# Altium project Expand_Board.PrjPcb
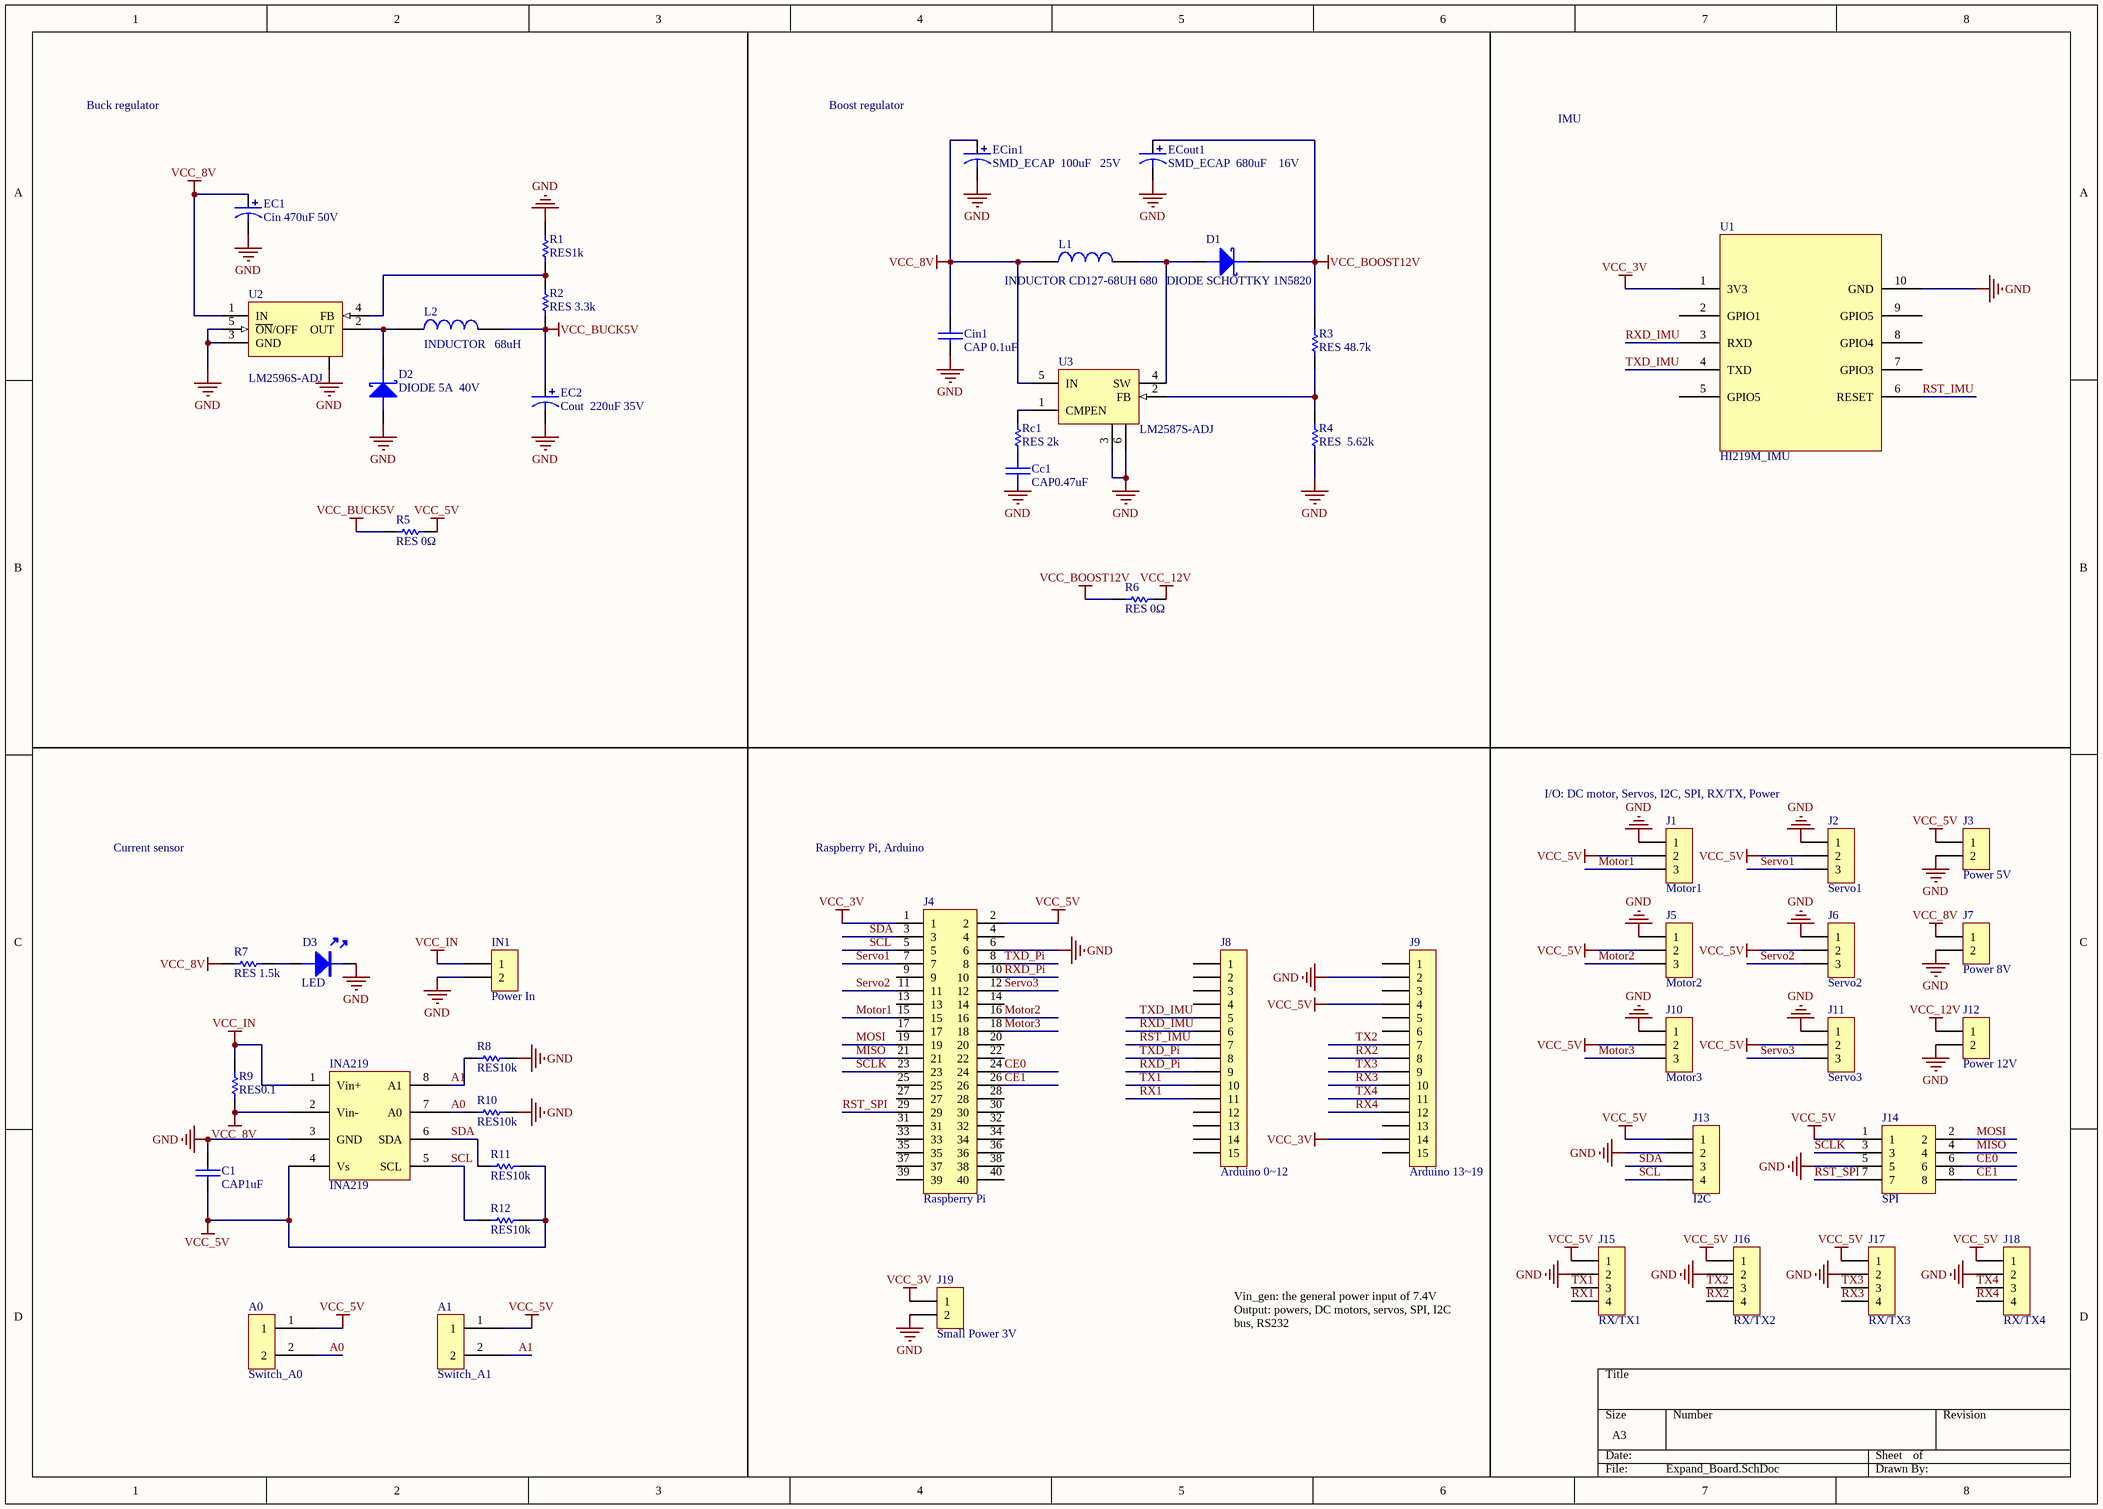
[diagram p0: Expand_Board.SchDoc]
1 sheet, 51 parts. Net scope: global (net labels, ports and power ports of the same name join across sheets).
Board file: Expand_Board.PcbDoc

## Sheet Expand_Board.SchDoc
size A3

### Parts
A0  Switch_A0  [TSOP65P180X145-2N]
A1  Switch_A1  [TSOP65P180X145-2N]
C1  CAP1uF  [0603C]
Cc1  CAP0.47uF  [0805C]
Cin1  CAP 0.1uF  [0805C]
D1  DIODE SCHOTTKY 1N5820  [SMA/DO-214AC]
D2  DIODE 5A  40V  [SMA/DO-214AC]
D3  LED  [LED-0603B]
EC1  Cin 470uF 50V  [SMD-EC8X8X10]
EC2  Cout  220uF 35V  [SMD-EC8X8X10]
ECin1  SMD_ECAP  100uF   25V  [SMD-EC8X8X10]
ECout1  SMD_ECAP  680uF    16V  [SMD-EC8X8X10]
IN1  Power In  [Pin HDR1X2/2.54mm-S]
INA219  INA219  [INA219]
J1  Motor1  [Pin HDR1X3/2.54mm-S]
J2  Servo1  [Pin HDR1X3/2.54mm-S]
J3  Power 5V  [Pin HDR1X2/2.54mm-S]
J4  Raspberry Pi  [Pin HDR2X20/2.54mm-S]
J5  Motor2  [Pin HDR1X3/2.54mm-S]
J6  Servo2  [Pin HDR1X3/2.54mm-S]
J7  Power 8V  [Pin HDR1X2/2.54mm-S]
J8  Arduino 0~12  [Pin HDR1X15/2.54mm-S]
J9  Arduino 13~19  [Pin HDR1X15/2.54mm-S]
J10  Motor3  [Pin HDR1X3/2.54mm-S]
J11  Servo3  [Pin HDR1X3/2.54mm-S]
J12  Power 12V  [Pin HDR1X2/2.54mm-S]
J13  I2C  [Pin HDR1X4/2.54mm-S]
J14  SPI  [Pin HDR2X4/2.54mm-S]
J15  RX/TX1  [Pin HDR1X4/2.54mm-S]
J16  RX/TX2  [Pin HDR1X4/2.54mm-S]
J17  RX/TX3  [Pin HDR1X4/2.54mm-S]
J18  RX/TX4  [Pin HDR1X4/2.54mm-S]
J19  Small Power 3V  [Pin HDR1X2/2.54mm-S]
L1  INDUCTOR CD127-68UH 680  [CDRH127]
L2  INDUCTOR   68uH  [CDRH127]
R1  RES1k  [0603R]
R2  RES 3.3k  [0603R]
R3  RES 48.7k  [0603R]
R4  RES  5.62k  [0603R]
R5  RES 0Ω  [0603R]
R6  RES 0Ω  [0603R]
R7  RES 1.5k  [0603R]
R8  RES10k  [0603R]
R9  RES0.1  [2512R]
R10  RES10k  [0603R]
R11  RES10k  [0603R]
R12  RES10k  [0603R]
Rc1  RES 2k  [0603R]
U1  HI219M_IMU  [SON127P1220X265-10N]
U2  LM2596S-ADJ  [TO-263-5]
U3  LM2587S-ADJ  [TO-263-5]

### Nets
GND: C1.2 Cc1.1 Cin1.1 D2.A D3.K EC1.2 EC2.2 ECin1.2 ECout1.2 IN1.2 INA219.3(GND) J1.1 J2.1 J3.2 J4.6 J5.1 J6.1 J7.2 J9.2 J10.1 J11.1 J12.2 J13.2 J14.5 J15.2 J16.2 J17.2 J18.2 J19.2 R1.2 R4.1 R8.2 R10.2 U1.10(GND) U2.3(GND) U2.5(~{ON}/OFF) U2.6 U3.3(GND) U3.6
VCC_3V: J4.1 J9.14 J19.1 U1.1(3V3)
VCC_5V: A0.1 A1.1 C1.1 INA219.4(Vs) J1.2 J2.2 J3.1 J4.2 J5.2 J6.2 J9.4 J10.2 J11.2 J13.1 J14.1 J15.1 J16.1 J17.1 J18.1 R5.2 R11.2 R12.2
VCC_8V: Cin1.2 EC1.1 ECin1.1 INA219.2(Vin-) J7.1 L1.1 R7.2 R9.2 U2.1(IN) U3.5(IN)
VCC_12V: J12.1 R6.2
VCC_BOOST12V: D1.K ECout1.1 R3.2 R6.1
VCC_BUCK5V: EC2.1 L2.2 R2.1 R5.1
VCC_IN: IN1.1 INA219.1(Vin+) R9.1
A0: A0.2 INA219.7(A0) R10.1
A1: A1.2 INA219.8(A1) R8.1
CE0: J4.24 J14.6
CE1: J4.26 J14.8
MISO: J4.21 J14.4
MOSI: J4.19 J14.2
Motor1: J1.3 J4.15
Motor2: J4.16 J5.3
Motor3: J4.18 J10.3
RST_IMU: J8.7 U1.6(RESET)
RST_SPI: J4.29 J14.7
RX1: J8.11 J15.4
RX2: J9.8 J16.4
RX3: J9.10 J17.4
RX4: J9.12 J18.4
RXD_IMU: J8.6 U1.3(RXD)
RXD_Pi: J4.10 J8.9
SCL: INA219.5(SCL) J4.5 J13.4 R12.1
SCLK: J4.23 J14.3
SDA: INA219.6(SDA) J4.3 J13.3 R11.1
Servo1: J2.3 J4.7
Servo2: J4.11 J6.3
Servo3: J4.12 J11.3
TX1: J8.10 J15.3
TX2: J9.7 J16.3
TX3: J9.9 J17.3
TX4: J9.11 J18.3
TXD_IMU: J8.5 U1.4(TXD)
TXD_Pi: J4.8 J8.8
NetCc1_2: Cc1.2 Rc1.1
NetD1_A: D1.A L1.2 U3.4(SW)
NetD2_K: D2.K L2.1 U2.2(OUT)
NetD3_A: D3.A R7.1
NetR1_1: R1.1 R2.2 U2.4(FB)
NetR3_1: R3.1 R4.2 U3.2(FB)
NetRc1_2: Rc1.2 U3.1(CMPEN)

Not connected (* = marked no-connect by the designer): J4 4 9 13 14 17 20 22 25 27 28 30 31 32 33 34 35 36 37 38 39 40; J8 1 2 3 4 12 13 14 15; J9 1 3 5 6 13 15; U1 2(GPIO1) 5(GPIO5) 7(GPIO3) 8(GPIO4) 9(GPIO5)

### Notes on the sheet
- Buck regulator
- Boost regulator
- IMU
- Current sensor
- Raspberry Pi, Arduino
- I/O: DC motor, Servos, I2C, SPI, RX/TX, Power
- Vin_gen: the general power input of 7.4V
  Output: powers, DC motors, servos, SPI, I2C bus, RS232

### Library data of the parts
A0 A1 U1 = Component_1
C1 Cc1 Cin1 = CAP: 无极性电容
D1 D2 = DIODE SCHOTTKY: 肖特基二极管
EC1 EC2 ECin1 ECout1 = SMD_ECAP: 贴片电解电容
IN1 J3 J7 J12 J19 = Pin HDR1X2
J1 J2 J5 J6 J10 J11 = Pin HDR1X3
J4 = Pin HDR2X20
J8 J9 = Pin HDR1X15
J13 J15-J18 = Pin HDR1X4
J14 = Pin HDR2X4
L1 L2 = INDUCTOR
R1-R12 Rc1 = RES
U2 = LM2596S-ADJ: 可调稳压芯片; Note: Tab is connected to GND; Published: 15-Apr-2002; DatasheetVersion: Dec-1997; PackageReference: TS5B; Publisher: Altium Limited; PackageDescription: D2-PAK; 5 Leads; Body 14.4 (inc. leads) x 10.4 mm (LxW max); ComponentLink1Description: Manufacturer Link; ComponentLink1URL: http://www.national.com/; ComponentLink2Description: Datasheet; ComponentLink2URL: http://www.national.com/ds.cgi/LM/LM2596.pdf; ComponentLink3Description: URL Link1; ComponentLink3URL: http://www.national.com/pf/LM/LM2596.html
U3 = LM2577S-ADJ: DC升压; Note: Tab is connected to GND; Published: 15-Apr-2002; DatasheetVersion: Jun-1999; PackageVersion: 2000; PackageReference: T05A; Publisher: Altium Limited; PackageDescription: TO, Thru-Hole, Vertical, Heatsink Mounted; 5 In-Line Leads; Pitch 1.70 mm; Code_JEDEC: TS-001-AA; ComponentLink1Description: Manufacturer Link; ComponentLink1URL: http://www.national.com/; ComponentLink2Description: Datasheet; ComponentLink2URL: http://www.national.com/ds.cgi/LM/LM1577.pdf; ComponentLink3Description: URL Link1; ComponentLink3URL: http://www.national.com/pf/LM/LM2577.html